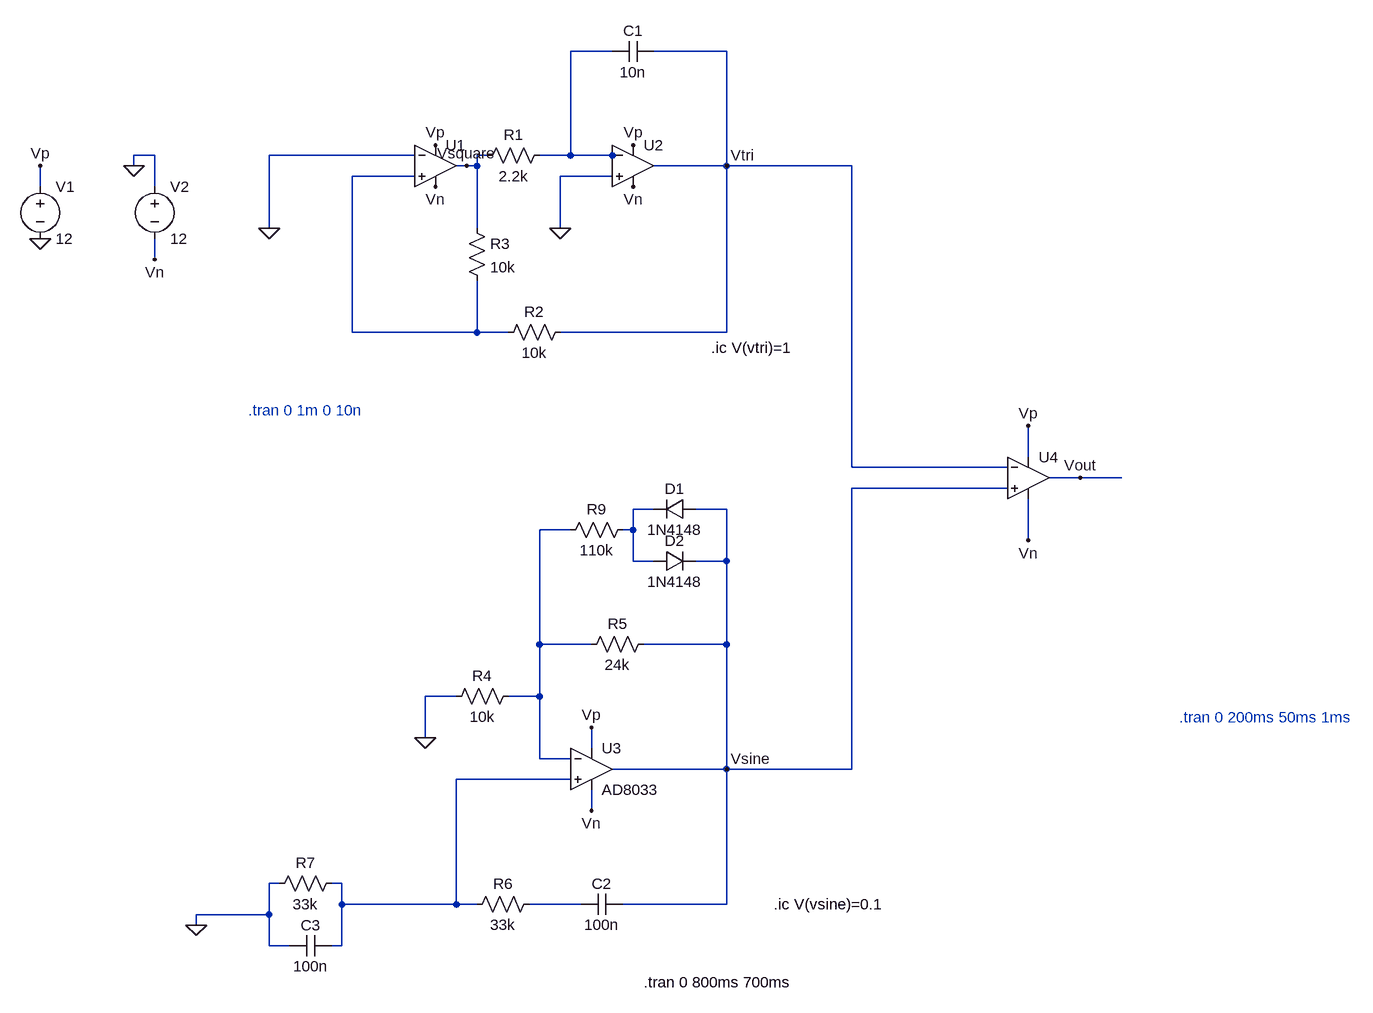
[diagram p0: schematic spwm_generator.asc]
spwm_generator.asc, the LTspice schematic file:
Version 4
SHEET 1 1544 1432
WIRE 336 -16 272 -16
WIRE 512 -16 400 -16
WIRE -368 144 -400 144
WIRE 32 144 -192 144
WIRE 144 144 128 144
WIRE 272 144 272 -16
WIRE 272 144 224 144
WIRE 336 144 272 144
WIRE 352 144 336 144
WIRE -400 160 -400 144
WIRE 112 160 96 160
WIRE 128 160 128 144
WIRE 128 160 112 160
WIRE 512 160 512 -16
WIRE 512 160 400 160
WIRE 704 160 512 160
WIRE 32 176 -64 176
WIRE 336 176 256 176
WIRE -544 192 -544 160
WIRE -368 192 -368 144
WIRE -192 256 -192 144
WIRE 128 256 128 160
WIRE 256 256 256 176
WIRE -368 304 -368 272
WIRE -64 416 -64 176
WIRE 128 416 128 336
WIRE 128 416 -64 416
WIRE 176 416 128 416
WIRE 512 416 512 160
WIRE 512 416 256 416
WIRE 976 608 976 560
WIRE 704 624 704 160
WIRE 944 624 704 624
WIRE 1056 640 1008 640
WIRE 1120 640 1056 640
WIRE 944 656 704 656
WIRE 400 688 368 688
WIRE 512 688 464 688
WIRE 272 720 224 720
WIRE 368 720 368 688
WIRE 368 720 352 720
WIRE 976 736 976 672
WIRE 368 768 368 720
WIRE 400 768 368 768
WIRE 512 768 512 688
WIRE 512 768 464 768
WIRE 224 896 224 720
WIRE 304 896 224 896
WIRE 512 896 512 768
WIRE 512 896 384 896
WIRE 96 976 48 976
WIRE 224 976 224 896
WIRE 224 976 176 976
WIRE 48 1040 48 976
WIRE 304 1056 304 1024
WIRE 224 1072 224 976
WIRE 272 1072 224 1072
WIRE 512 1088 512 896
WIRE 512 1088 336 1088
WIRE 704 1088 704 656
WIRE 704 1088 512 1088
WIRE 272 1104 96 1104
WIRE 304 1152 304 1120
WIRE -176 1264 -192 1264
WIRE -80 1264 -96 1264
WIRE -80 1296 -80 1264
WIRE 96 1296 96 1104
WIRE 96 1296 -80 1296
WIRE 128 1296 96 1296
WIRE 288 1296 208 1296
WIRE 512 1296 512 1088
WIRE 512 1296 352 1296
WIRE -192 1312 -192 1264
WIRE -192 1312 -304 1312
WIRE -304 1328 -304 1312
WIRE -192 1360 -192 1312
WIRE -160 1360 -192 1360
WIRE -80 1360 -80 1296
WIRE -80 1360 -96 1360
FLAG 256 256 0
FLAG -192 256 0
FLAG -544 272 0
FLAG -400 160 0
FLAG -544 160 Vp
FLAG -368 304 Vn
FLAG 64 192 Vn
FLAG 368 192 Vn
FLAG 64 128 Vp
FLAG 368 128 Vp
FLAG 512 160 Vtri
FLAG 112 160 Vsquare
FLAG 48 1040 0
FLAG -304 1328 0
FLAG 512 1088 Vsine
FLAG 304 1024 Vp
FLAG 304 1152 Vn
FLAG 976 560 Vp
FLAG 976 736 Vn
FLAG 1056 640 Vout
SYMBOL res 272 400 R90
WINDOW 0 0 56 VBottom 2
WINDOW 3 32 56 VTop 2
SYMATTR InstName R2
SYMATTR Value 10k
SYMBOL cap 400 -32 R90
WINDOW 0 0 32 VBottom 2
WINDOW 3 32 32 VTop 2
SYMATTR InstName C1
SYMATTR Value 10n
SYMBOL res 112 240 R0
SYMATTR InstName R3
SYMATTR Value 10k
SYMBOL res 240 128 R90
WINDOW 0 0 56 VBottom 2
WINDOW 3 32 56 VTop 2
SYMATTR InstName R1
SYMATTR Value 2.2k
SYMBOL voltage -544 176 R0
WINDOW 123 0 0 Left 0
WINDOW 39 0 0 Left 0
SYMATTR InstName V1
SYMATTR Value 12
SYMBOL voltage -368 176 R0
WINDOW 123 0 0 Left 0
WINDOW 39 0 0 Left 0
SYMATTR InstName V2
SYMATTR Value 12
SYMBOL OpAmps\\UniversalOpAmp2 64 160 R0
SYMATTR InstName U1
SYMATTR SpiceLine Ilimit=1 Rail=1 Vos=0
SYMBOL OpAmps\\UniversalOpAmp2 368 160 R0
SYMATTR InstName U2
SYMBOL OpAmps\\AD8033 304 1024 R0
SYMATTR InstName U3
SYMBOL res 192 960 R90
WINDOW 0 0 56 VBottom 2
WINDOW 3 32 56 VTop 2
SYMATTR InstName R4
SYMATTR Value 10k
SYMBOL res 400 880 R90
WINDOW 0 0 56 VBottom 2
WINDOW 3 32 56 VTop 2
SYMATTR InstName R5
SYMATTR Value 24k
SYMBOL res 224 1280 R90
WINDOW 0 0 56 VBottom 2
WINDOW 3 32 56 VTop 2
SYMATTR InstName R6
SYMATTR Value 33k
SYMBOL cap 352 1280 R90
WINDOW 0 0 32 VBottom 2
WINDOW 3 32 32 VTop 2
SYMATTR InstName C2
SYMATTR Value 100n
SYMBOL cap -96 1344 R90
WINDOW 0 0 32 VBottom 2
WINDOW 3 32 32 VTop 2
SYMATTR InstName C3
SYMATTR Value 100n
SYMBOL res -80 1248 R90
WINDOW 0 0 56 VBottom 2
WINDOW 3 32 56 VTop 2
SYMATTR InstName R7
SYMATTR Value 33k
SYMBOL OpAmps\\UniversalOpAmp2 976 640 R0
SYMATTR InstName U4
SYMBOL res 368 704 R90
WINDOW 0 0 56 VBottom 2
WINDOW 3 32 56 VTop 2
SYMATTR InstName R9
SYMATTR Value 110k
SYMBOL diode 464 672 R90
WINDOW 0 0 32 VBottom 2
WINDOW 3 32 32 VTop 2
SYMATTR InstName D1
SYMATTR Value 1N4148
SYMBOL diode 400 784 R270
WINDOW 0 32 32 VTop 2
WINDOW 3 0 32 VBottom 2
SYMATTR InstName D2
SYMATTR Value 1N4148
TEXT -224 536 Left 2 ;.tran 0 1m 0 10n
TEXT 488 440 Left 2 !.ic V(vtri)=1
TEXT 384 1416 Left 2 !.tran 0 800ms 700ms
TEXT 584 1296 Left 2 !.ic V(vsine)=0.1
TEXT 1208 1008 Left 2 ;.tran 0 200ms 50ms 1ms

The netlist it stands for:
* spwm_generator.asc
R2 Vtri N002 10k
C1 Vtri N001 10n
R3 Vsquare N002 10k
R1 N001 Vsquare 2.2k
V1 Vp 0 12
V2 0 Vn 12
XU1 N002 0 Vp Vn Vsquare level2 Avol=1Meg GBW=10Meg Slew=10Meg Ilimit=1 Rail=1 Vos=0 En=0 Enk=0 In=0 Ink=0 Rin=500Meg  ; pins In+ In- V+ V- OUT
XU2 0 N001 Vp Vn Vtri level2 Avol=1Meg GBW=10Meg Slew=10Meg Ilimit=25m Rail=0 Vos=0 En=0 Enk=0 In=0 Ink=0 Rin=500Meg  ; pins In+ In- V+ V- OUT
XU3 N005 N004 Vp Vn Vsine AD8033  ; pins In+ In- V+ V- OUT
R4 N004 0 10k
R5 Vsine N004 24k
R6 N006 N005 33k
C2 Vsine N006 100n
C3 N005 0 100n
R7 N005 0 33k
XU4 Vsine Vtri Vp Vn Vout level2 Avol=1Meg GBW=10Meg Slew=10Meg Ilimit=25m Rail=0 Vos=0 En=0 Enk=0 In=0 Ink=0 Rin=500Meg  ; pins In+ In- V+ V- OUT
R9 N003 N004 110k
D1 Vsine N003 1N4148
D2 N003 Vsine 1N4148
.model D D
.lib standard.dio
* .tran 0 1m 0 10n
.ic V(vtri)=1
.tran 0 800ms 700ms
.ic V(vsine)=0.1
* .tran 0 200ms 50ms 1ms
.lib UniversalOpAmp2.lib
.backanno
.end